# EAGLE design 555-pwm-eagle (EAGLE 5.07)

## Sheet 1 of 2
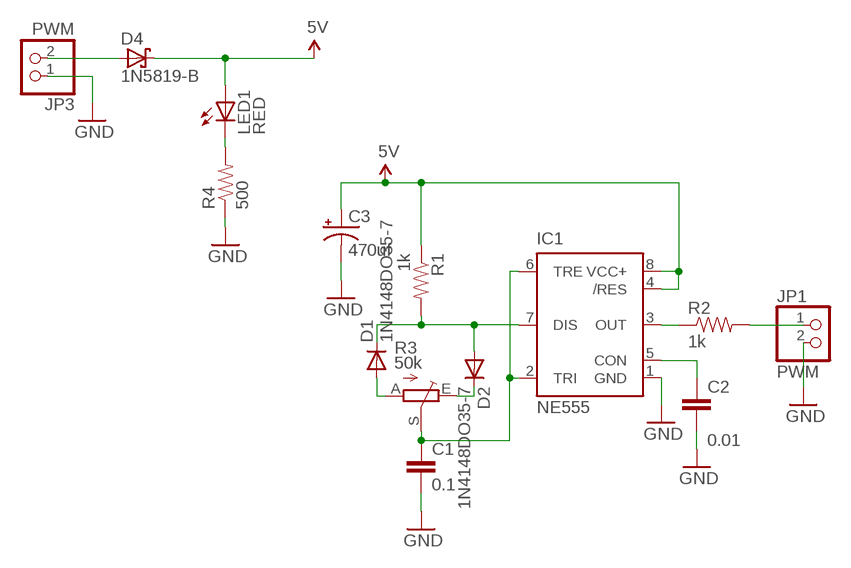
[diagram p0: schematic, sheet 1]

### Parts
C1  0.1  CAPPTH  [CAP-PTH-SMALL]
C2  0.01  CAPPTH  [CAP-PTH-SMALL]
C3  470uf  CAP_POLPTH1  [CPOL-RADIAL-100UF-25V]
D1  1N4148DO35-7  [DO35-7]
D2  1N4148DO35-7  [DO35-7]
D4  1N5819-B  [DO41-7.6]
IC1  NE555  [DIL-08]
JP1  PWM  PINHD-1X2  [1X02]
JP3  PWM  PINHD-1X2  [1X02]
LED1  RED  LED3MM  [LED3MM]
R1  1k  RESISTORPTH1  [AXIAL-0.3]
R2  1k  RESISTORPTH1  [AXIAL-0.3]
R3  50k  TRIM_EU-B64Y  [B64Y]
R4  500  RESISTORPTH1  [AXIAL-0.3]

### Nets
5V: C3.1(+) D4.C IC1.4(/RES) IC1.8(VCC+) LED1.A R1.P$1 ; also sheet 2
GND: C1.2 C2.2 C3.2(-) IC1.1(GND) JP1.2 JP3.1 R4.P$1 ; also sheet 2
N$1: C1.1 IC1.2(TRI) IC1.6(TRE) R3.S
N$2: D1.C D2.A IC1.7(DIS) R1.P$2
N$4: LED1.K(C) R4.P$2
N$5: JP1.1 R2.P$2
N$6: C2.1 IC1.5(CON)
N$7: D1.A R3.A
N$8: IC1.3(OUT) R2.P$1
N$9: D2.C R3.E
N$15: D4.A JP3.2

## Sheet 2 of 2
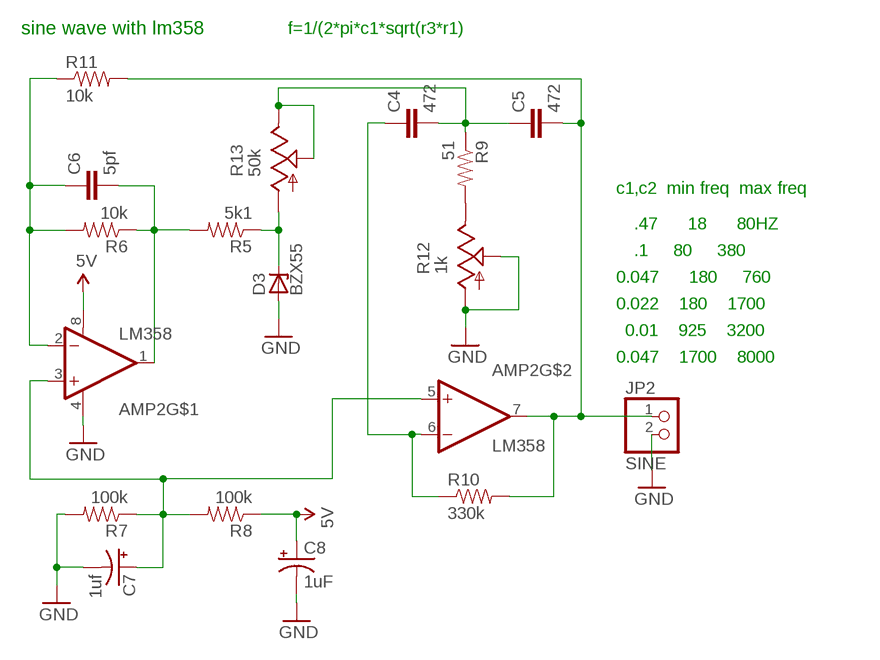
[diagram p1: schematic, sheet 2]

### Parts
AMP2  LM358  [DIP08]
C4  472  CAPPTH  [CAP-PTH-SMALL]
C5  472  CAPPTH  [CAP-PTH-SMALL]
C6  5pf  CAPPTH  [CAP-PTH-SMALL]
C7  1uf  CAP_POLPTH2  [CPOL-RADIAL-10UF-25V]
C8  1uF  CAP_POLPTH2  [CPOL-RADIAL-10UF-25V]
D3  BZX55  [DO35Z10]
JP2  SINE  PINHD-1X2  [1X02]
R5  5k1  RESISTORPTH1  [AXIAL-0.3]
R6  10k  RESISTORPTH1  [AXIAL-0.3]
R7  100k  RESISTORPTH1  [AXIAL-0.3]
R8  100k  RESISTORPTH1  [AXIAL-0.3]
R9  51  RESISTORPTH1  [AXIAL-0.3]
R10  330k  RESISTORPTH1  [AXIAL-0.3]
R11  10k  RESISTORPTH1  [AXIAL-0.3]
R12  1k  TRIM_US-B64Y  [B64Y]
R13  50k  TRIM_US-B64Y  [B64Y]

### Nets
5V: AMP2.8(V+) C8.1(+) R8.P$1 ; also sheet 1
GND: AMP2.4(V-) C7.2(-) C8.2(-) D3.A JP2.2 R7.P$2 R12.A R12.S ; also sheet 1
N$12: AMP2.2(-IN) C6.1 R6.P$2 R11.P$1
N$13: AMP2.1(OUT) C6.2 R5.P$2 R6.P$1
N$14: R9.P$2 R12.E
N$16: D3.C R5.P$1 R13.A
N$17: C4.2 C5.1 R9.P$1 R13.E R13.S
N$19: AMP2.3(+IN) AMP2.5(+IN) C7.1(+) R7.P$1 R8.P$2
N$23: AMP2.6(-IN) C4.1 R10.P$1
N$24: AMP2.7(OUT) C5.2 JP2.1 R10.P$2 R11.P$2

### Notes on the sheet
- sine wave with lm358 | f=1/(2*pi*c1*sqrt(r3*r1)
- c1,c2  min freq  max freq
- .47      18      80HZ
- .1     80     380
- 0.047      180     760
- 0.022    180    1700
- 0.01    925    3200
- 0.047    1700    8000

## Library data of the parts
AMP2 = SparkFun:LM358
C1 C2 C4-C6 = SparkFun:CAP: Capacitor Standard 0603 ceramic capacitor, and 0.1" leaded capacitor.
C3 C7 C8 = SparkFun:CAP_POL: Capacitor Polarized These are standard SMD and PTH capacitors. Normally 10uF, 47uF, and 100uF in electrolytic and tantalum varieties. Always verify the external diameter of the through hole cap, it varies with capacity, voltage, and manufacturer. The EIA devices should be standard.
D1 D2 = diode:1N4148: DIODE high speed (Philips)
D3 = diode:BZX55: Z DIODE
D4 = diode:1N581*: 1.0A SCHOTTKY BARRIER RECTIFIER Source: http://www.diodes.com/datasheets/ds23001.pdf
IC1 = st-microelectronics:NE555: General purpose bipolar Timer
JP1-JP3 = pinhead:PINHD-1X2: PIN HEADER
LED1 = SparkFun:LED: LEDs Standard schematic elements and footprints for 5mm, 3mm, 1206, and 0603 sized LEDs. 5mm - Spark Fun Electronics SKU : COM-00529 (and others)
R1 R2 R4-R11 = SparkFun:RESISTOR: Resistor Basic schematic elements and footprints for 0603, 1206, and PTH 1/10th watt (small) resistors.
R3 = pot:TRIM_EU-: POTENTIOMETER
R12 R13 = pot:TRIM_US-: POTENTIOMETER

## Board
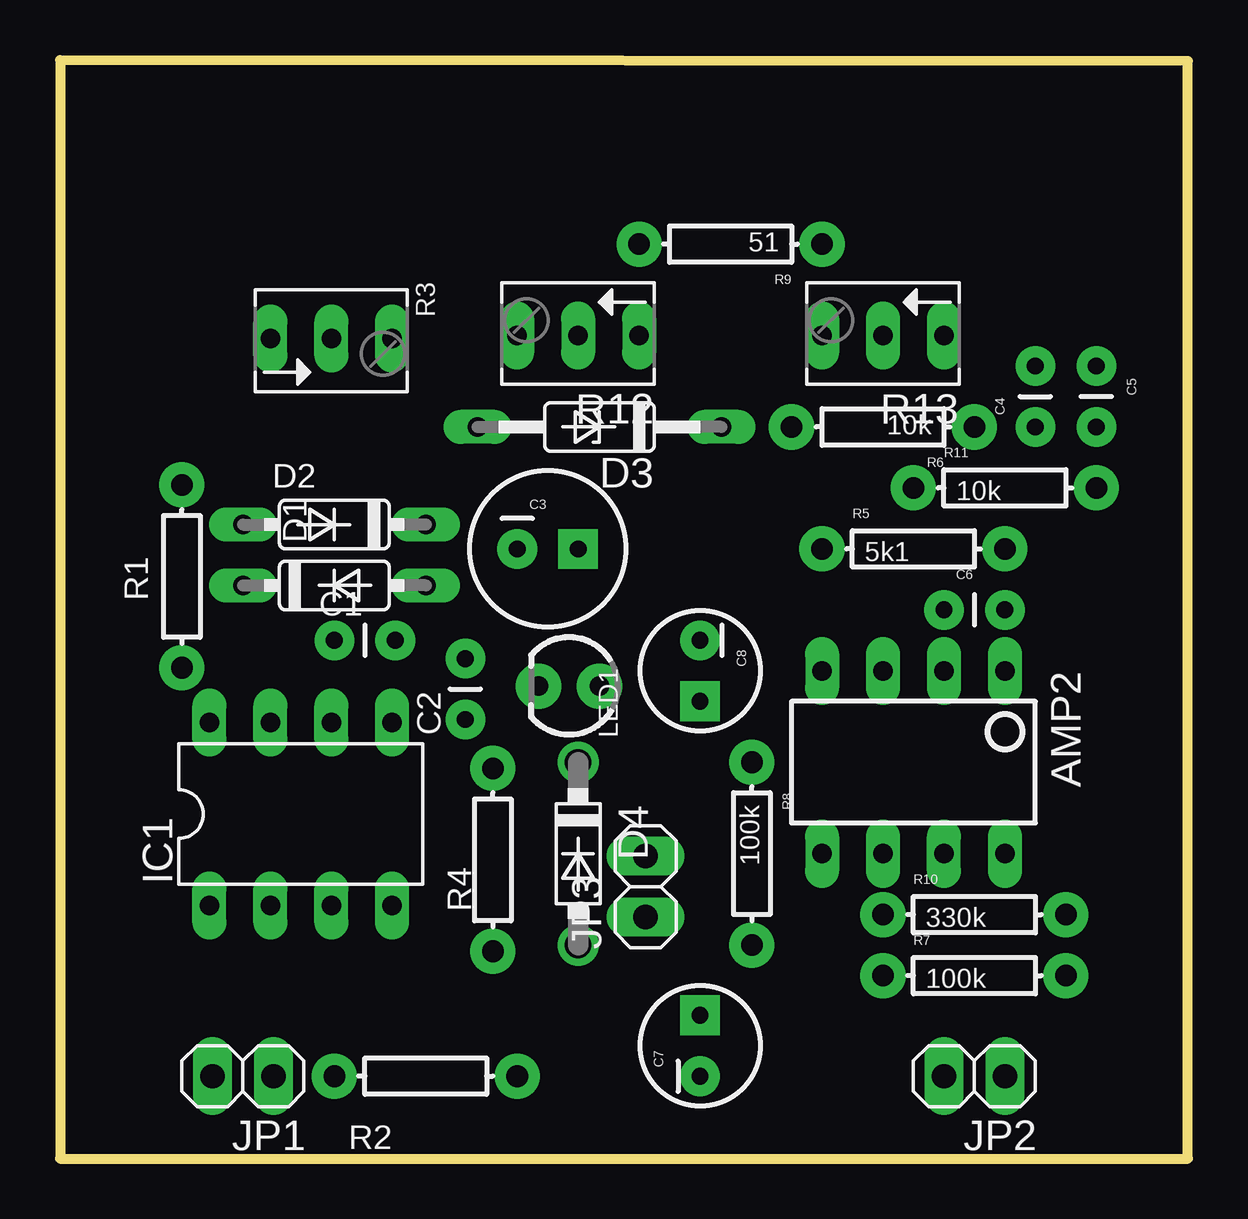
[diagram p2: board, top side]
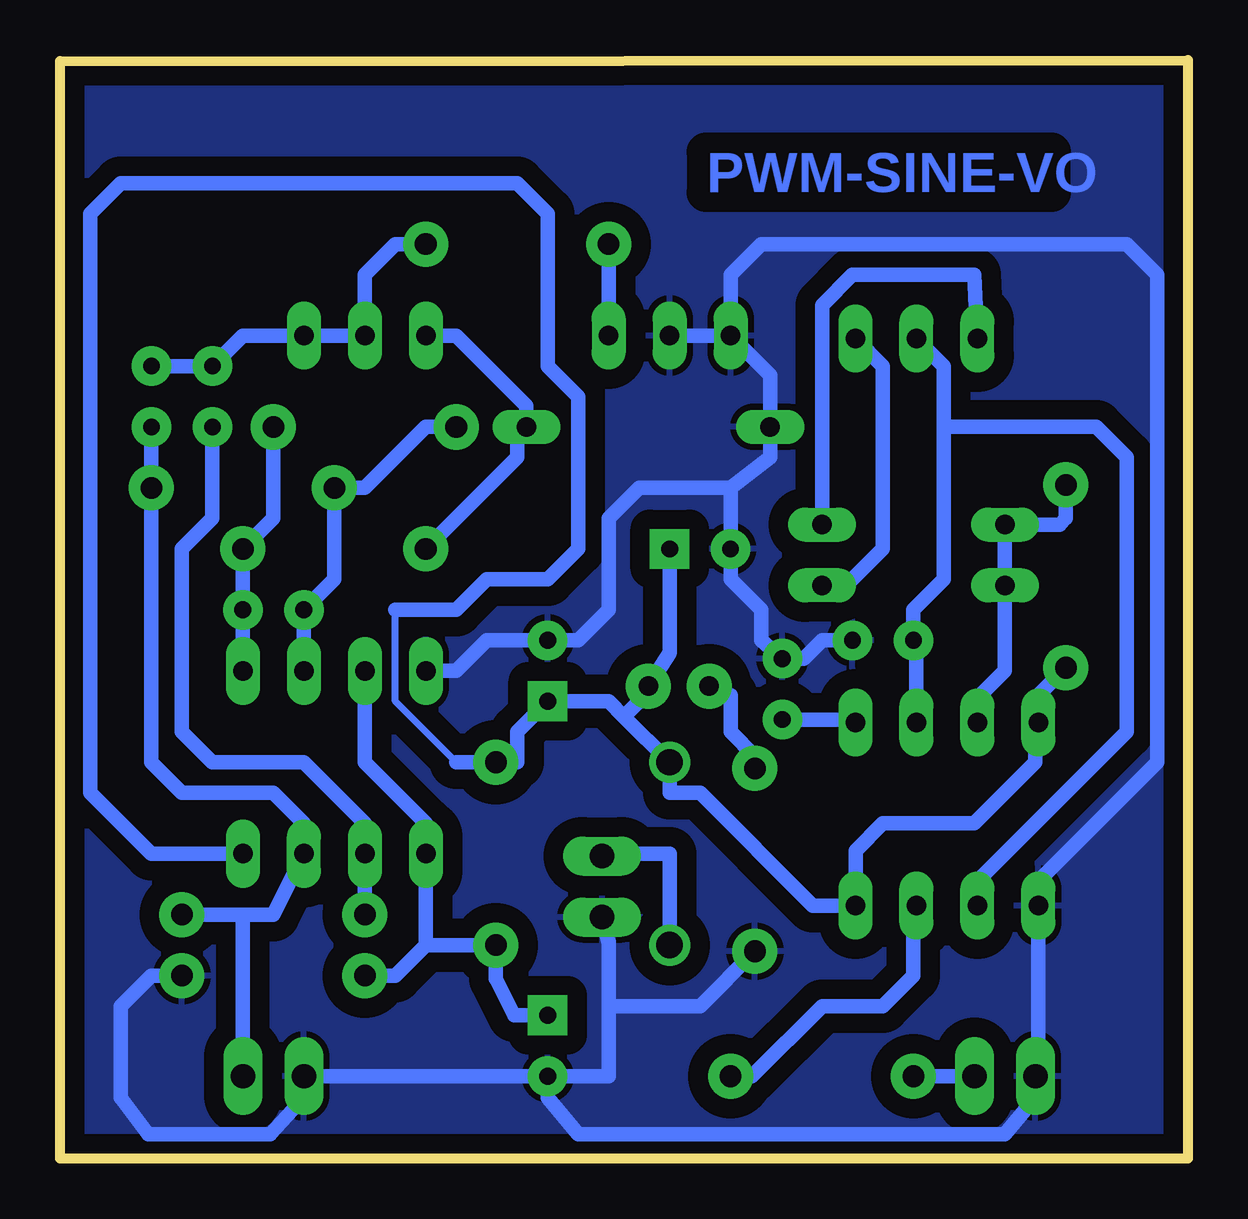
[diagram p3: board, bottom side, seen from below]

Size 46.99 x 45.77 mm. Coordinates in mm from the lower left corner, seen from the top.
Outline: 0,0 46.99,0 46.99,45.72 0,45.77 0,0
Copper layers (1*16): Top 0.035mm / dielectric 1.5mm / Bottom 0.035mm
Design rules "SparkFun-diy": minimum track width 8mil, minimum drill 20mil, track to track 10mil, track to pad 10mil, pad to pad 10mil, via to via 10mil, smd to smd 10mil, copper to edge 10mil, drill to drill 8mil, minimum pad ring 12mil, minimum via ring 10mil, stop-mask expansion 4mil, vias tented up to drill 25mil, thermal gap 10mil

### Footprints (pad centres in the part's own frame; a part is rotated, then mirrored left to right if it is on the bottom)
DIP08-L = drill 0.813 long: 1 0,-2.54; 2 2.54,-2.54; 3 5.08,-2.54; 4 7.62,-2.54; 5 7.62,5.08; 6 5.08,5.08; 7 2.54,5.08; 8 0,5.08
CAP-PTH-SMALL = drill 0.7 pad 1.651 round: 1 0,0; 2 2.54,0
CPOL-RADIAL-100UF-25V = drill 0.7 pad 1.651 square: 1 1.27,0 | drill 0.7 pad 1.651 round: 2 -1.27,0
CPOL-RADIAL-10UF-25V = drill 0.7 pad 1.651 square: 1 1.27,0 | drill 0.7 pad 1.651 round: 2 -1.27,0
DO35-7 = drill 0.813 long: A 3.81,0; C -3.81,0
DO35Z10 = drill 0.813 long: A 5.08,0; C -5.08,0
DO41-7.6 = drill 1.1 pad 1.7 round: A 3.81,0; C -3.81,0
DIL-08 = drill 0.813 long: 1 -3.81,-3.81; 2 -1.27,-3.81; 3 1.27,-3.81; 4 3.81,-3.81; 5 3.81,3.81; 6 1.27,3.81; 7 -1.27,3.81; 8 -3.81,3.81
1X02 = drill 1.016 long: 1 -1.27,0; 2 1.27,0
LED3MM = drill 0.813 pad 1.88 round: A -1.27,0; K 1.27,0
AXIAL-0.3 = drill 0.9 pad 1.88 round: P$1 -3.81,0; P$2 3.81,0
B64Y = drill 0.813 long: A 2.54,0; E -2.54,0; S 0,0

### Placement (x,y rotation side)
AMP2  LM358LM358L  [DIP08-L]  39.37,17.78 180 top
C1  11.43,21.59 0 top
C2  16.89,18.29 90 top
C3  20.32,25.4 0 top
C4  40.64,30.48 90 top
C5  43.18,33.02 270 top
C6  36.83,22.86 0 top
C7  26.67,4.7 90 top
C8  26.67,20.32 270 top
D1  11.43,23.88 0 top
D2  11.43,26.42 180 top
D3  22.48,30.48 180 top
D4  21.59,12.7 270 top
IC1  10.03,14.35 0 top
JP1  7.62,3.43 180 top
JP2  38.1,3.43 180 top
JP3  24.4,11.33 90 top
LED1  21.21,19.68 180 top
R1  5.08,24.26 90 top
R2  15.24,3.43 180 top
R3  11.3,34.16 0 top
R4  18.03,12.45 90 top
R5  35.56,25.4 0 top
R6  34.29,30.48 180 top
R7  38.1,7.62 0 top
R8  28.83,12.7 270 top
R9  27.94,38.1 180 top
R10  38.1,10.16 0 top
R11  39.37,27.94 0 top
R12  21.59,34.29 180 top
R13  34.29,34.29 180 top

### Tracks (layer width: path | path; a pad name or v marks a point on that pad's centre or on a via)
5V
  Bottom 0.254: 6.35,18.03 IC1.8
  Bottom 0.3: 33.02,22.86 33.02,19.05 30.48,16.51
  Bottom 0.61: 6.35,18.03 6.35,16.51 8.89,13.97 12.7,13.97 13.84,12.83 IC1.4 15.62,10.54 20.32,15.24 21.59,15.24 D4.C 23.5,18.41 | AMP2.8 43.18,12.7 45.72,15.24 45.72,39.37 44.45,40.64 27.94,40.64 26.67,39.37 26.67,33.02 25.4,31.75 25.4,25.4 26.67,24.13 29.21,24.13 30.48,22.86 33.02,22.86 | 30.48,16.51 R8.P$1 27.94,16.51 27.94,17.78 C8.1 24.13,19.05 23.5,18.41 | IC1.8 6.22,19.3 R1.P$1 | 23.5,18.41 22.35,19.56 LED1.A 21.59,21.08 C3.1
GND
  Bottom 0.61: C7.2 JP2.2 36.83,2.54 38.23,1.02 43.31,1.02 44.45,2.54 44.45,6.35 43.18,7.62 R7.P$2 | C1.2 15.24,21.59 16,20.83 C2.2 17.78,21.59 17.78,22.86 19.05,24.13 C3.2 19.05,27.94 | R12.A R12.S | 19.05,27.94 22.86,27.94 24.13,26.67 24.13,22.86 25.4,21.59 C8.2 29.21,21.59 30.48,20.32 AMP2.4 | 19.05,27.94 17.4,29.21 D3.A 17.4,32.64 R12.A | JP3.1 24.13,9.02 24.13,6.35 | 24.13,6.35 20.32,6.35 R4.P$1 | R12.A 19.05,36.83 17.78,38.1 2.54,38.1 1.27,36.83 1.27,16.51 6.22,11.56 IC1.1 6.22,4.83 JP1.2 6.35,2.54 7.62,1.02 25.4,1.02 26.67,2.54 C7.2 | C7.2 24.13,3.43 24.13,6.35
  pour Bottom (isolate 0.813): -5.08,49.53 54.61,49.53 58.42,45.72 58.42,0 55.88,-2.54 -3.81,-2.54 -3.81,48.26
N$1
  Bottom 0.203: R3.S 11.43,33.02
  Bottom 0.406: 8.76,11.56 8.64,11.68 | 11.43,33.02 11.3,33.15
  Bottom 0.61: IC1.6 11.3,21.46 C1.1 11.43,22.86 10.16,24.13 10.16,30.48 | 10.16,30.48 3.81,30.48 2.54,29.21 2.54,17.78 8.64,11.68 | IC1.2 8.76,11.56 | R3.S 10.16,33.02 10.16,30.48
N$2
  Bottom 0.61: IC1.7 8.76,19.18 7.62,20.32 D1.C D2.A 5.33,26.42 5.08,26.67 R1.P$2
N$4
  Bottom 0.61: R4.P$2 18.03,16.76 19.05,17.78 19.05,19.3 LED1.K
N$5
  Bottom 0.61: JP1.1 R2.P$2
N$6
  Bottom 0.254: IC1.5 13.97,18.29
  Bottom 0.61: 13.97,18.29 C2.1
N$7
  Bottom 0.61: D1.A 14.22,23.88 12.7,25.4 12.7,33.02 R3.A
N$8
  Bottom 0.61: R2.P$1 18.16,3.43 15.24,6.35 12.7,6.35 11.43,7.62 11.43,10.41 IC1.3
N$9
  Bottom 0.61: R3.E 8.89,36.83 13.97,36.83 15.24,35.56 D2.C
N$12
  Bottom 0.61: AMP2.2 C6.1 35.56,24.13 R11.P$1 34.29,27.94 31.75,30.48 R6.P$2
N$13
  Bottom 0.61: AMP2.1 C6.2 R5.P$2 38.1,26.67 R6.P$1
N$14
  Bottom 0.61: R12.E R9.P$2
N$15
  Bottom 0.61: D4.A 21.59,12.7 24.13,12.7 JP3.2
N$16
  Bottom 0.61: R5.P$1 27.94,29.21 27.94,30.1 D3.C 27.56,31.37 30.48,34.29 R13.A
N$17
  Bottom 0.61: C5.1 C4.2 39.37,34.29 R13.E R13.S 34.29,36.83 33.02,38.1 R9.P$1
N$19
  Bottom 0.61: 31.75,8.89 AMP2.5 31.75,13.97 34.29,16.51 AMP2.3 | 31.75,8.89 R8.P$2 28.83,7.49 28.07,5.97 C7.1 | R7.P$1 33.02,7.62 31.75,8.89
N$23
  Bottom 0.61: R10.P$1 AMP2.6 34.29,13.97 36.83,16.51 40.64,16.51 41.91,17.78 41.91,25.4 40.64,26.67 C4.1
N$24
  Bottom 0.61: JP2.1 39.37,10.16 | 39.37,10.16 R10.P$2 | C5.2 R11.P$2 43.18,16.51 41.91,15.24 38.1,15.24 36.83,13.97 AMP2.7 38.1,10.16 39.37,10.16

### Text on the board
Bottom: PWM-SINE-VO